# Altium schematic sheet MKXdbV2_ADC1.SchDoc
size A
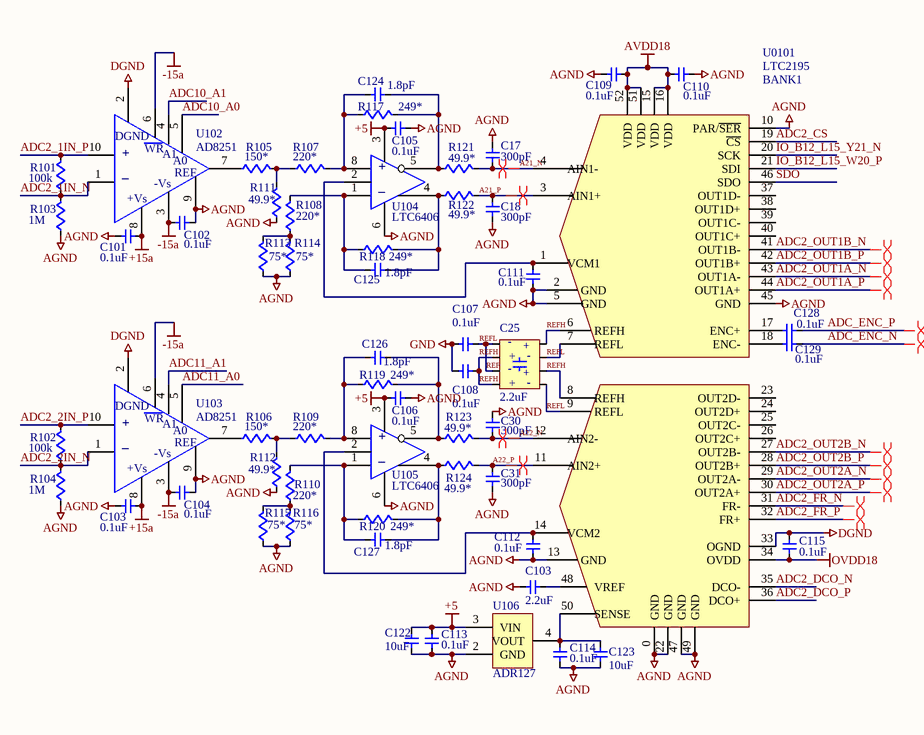
[diagram p0: MKXdbV2_ADC1.SchDoc]

## Parts
(Parts that share a designator on the sheet are numbered #1, #2 ... from top to bottom, then left to right.)
C17  300pF  [0603w]
C18  300pF  [0603w]
C25  2.2uF  [1206CLL]
C30  300pF  [0603w]
C31  300pF  [0603w]
C101  0.1uF  [0603w]
C102  0.1uF  [0603w]
C103#1  0.1uF  [0603w]
C103#2  2.2uF  [0603w]
C104  0.1uF  [0603w]
C105  0.1uF  [0603w]
C106  0.1uF  [0603w]
C107  0.1uF  [0603w]
C108  0.1uF  [0603w]
C109  0.1uF  [0603w]
C110  0.1uF  [0603w]
C111  0.1uF  [0603w]
C112  0.1uF  [0603w]
C113  0.1uF  [0603w]
C114  0.1uF  [0603w]
C115  0.1uF  [0603w]
C122  10uF  [0603w]
C123  10uF  [0603w]
C124  1.8pF  [0603w]
C125  1.8pF  [0603w]
C126  1.8pF  [0603w]
C127  1.8pF  [0603w]
C128  0.1uF  [1206]
C129  0.1uF  [1206]
R101  100k  [0603w]
R102  100k  [0603w]
R103  1M  [0603w]
R104  1M  [0603w]
R105  150*  [0603w]
R106  150*  [0603w]
R107  220*  [0603w]
R108  220*  [0603w]
R109  220*  [0603w]
R110  220*  [0603w]
R111  49.9*  [0603w]
R112  49.9*  [0603w]
R113  75*  [0603w]
R114  75*  [0603w]
R115  75*  [0603w]
R116  75*  [0603w]
R117  249*  [0603w]
R118  249*  [0603w]
R119  249*  [0603w]
R120  249*  [0603w]
R121  49.9*  [0603w]
R122  49.9*  [0603w]
R123  49.9*  [0603w]
R124  49.9*  [0603w]
U0101  LTC2195  [UKG - QFN52]
U102  AD8251  [MSOP10sm]
U103  AD8251  [MSOP10sm]
U104  LTC6406  [MSOP08]
U105  LTC6406  [MSOP08]
U106  ADR127  [TSOT-6]

## Nets
+5: C105.1 C106.1 C113.2 C122.1 U104.3 U105.3 U106.3(VIN)
+15a: C101.1 C103#1.1 U102.8 U103.8
-15a: C102.1 C104.1 U102.3 U102.6 U103.3 U103.6
AGND: C17.1 C18.2 C30.1 C31.2 C101.2 C102.2 C103#1.2 C103#2.2 C104.2 C105.2 C106.2 C109.2 C110.2 C111.2 C112.2 C113.1 C114.1 C122.2 C123.2 R103.1 R104.1 R111.1 R112.1 R113.1 R114.1 R115.1 R116.1 U0101.0(GND) U0101.2(GND) U0101.5(GND) U0101.10(PAR/~{SER}) U0101.13(GND) U0101.22(GND) U0101.45(GND) U0101.47(GND) U0101.49(GND) U102.9 U103.9 U104.6 U105.6 U106.2(GND)
AVDD18: C109.1 C110.1 U0101.15(VDD) U0101.16(VDD) U0101.51(VDD) U0101.52(VDD)
DGND: C115.1 U0101.33(OGND) U102.2 U103.2
GND: C107.2 C108.2
OVDD18: C115.2 U0101.34(OVDD)
A21_N: C17.2 R121.2 U0101.4(AIN1-)
A21_P: C18.1 R122.2 U0101.3(AIN1+)
A22_N: C30.2 R123.2 U0101.12(AIN2-)
A22_P: C31.1 R124.2 U0101.11(AIN2+)
ADC2_1IN_N: R101.1 R103.2 U102.1
ADC2_1IN_P: R101.2 U102.10
ADC2_2IN_N: R102.1 R104.2 U103.1
ADC2_2IN_P: R102.2 U103.10
ADC2_CS: U0101.19(~{CS})
ADC2_DCO_N: U0101.35(DCO-)
ADC2_DCO_P: U0101.36(DCO+)
ADC2_FR_N: U0101.31(FR-)
ADC2_FR_P: U0101.32(FR+)
ADC2_OUT1A_N: U0101.43(OUT1A-)
ADC2_OUT1A_P: U0101.44(OUT1A+)
ADC2_OUT1B_N: U0101.41(OUT1B-)
ADC2_OUT1B_P: U0101.42(OUT1B+)
ADC2_OUT2A_N: U0101.29(OUT2A-)
ADC2_OUT2A_P: U0101.30(OUT2A+)
ADC2_OUT2B_N: U0101.27(OUT2B-)
ADC2_OUT2B_P: U0101.28(OUT2B+)
ADC10_A0: U102.5
ADC10_A1: U102.4
ADC11_A0: U103.5
ADC11_A1: U103.4
ADC_ENC_N: C129.2
ADC_ENC_P: C128.2
IO_B12_L15_W20_P: U0101.21(SDI)
IO_B12_L15_Y21_N: U0101.20(SCK)
REFH: C25.2 C25.4 C25.6 C25.8 C108.1 U0101.6(REFH) U0101.8(REFH)
REFL: C25.1 C25.3 C25.5 C25.7 C107.1 U0101.7(REFL) U0101.9(REFL)
SDO: U0101.46(SDO)
NetC103#2_1: C103#2.1 U0101.48(VREF)
NetC111_1: C111.1 U0101.1(VCM1) U104.2
NetC112_1: C112.1 U0101.14(VCM2) U105.2
NetC114_2: C114.2 C123.1 U0101.50(SENSE) U106.4(VOUT)
NetC124_1: C124.1 R107.2 R117.1 U104.8
NetC124_2: C124.2 R117.2 R121.1 U104.5
NetC125_1: C125.1 R108.2 R118.1 U104.1
NetC125_2: C125.2 R118.2 R122.1 U104.4
NetC126_1: C126.1 R109.2 R119.1 U105.8
NetC126_2: C126.2 R119.2 R123.1 U105.5
NetC127_1: C127.1 R110.2 R120.1 U105.1
NetC127_2: C127.2 R120.2 R124.1 U105.4
NetC128_1: C128.1 U0101.17(ENC+)
NetC129_1: C129.1 U0101.18(ENC-)
NetR105_1: R105.1 U102.7
NetR105_2: R105.2 R107.1 R111.2
NetR106_1: R106.1 U103.7
NetR106_2: R106.2 R109.1 R112.2
NetR108_1: R108.1 R113.2 R114.2
NetR110_1: R110.1 R115.2 R116.2

Not connected (* = marked no-connect by the designer): U0101 23(OUT2D-) 24(OUT2D+) 25(OUT2C-) 26(OUT2C+) 37(OUT1D-) 38(OUT1D+) 39(OUT1C-) 40(OUT1C+); U106 1(NC) 5(NC) 6(NC)

## Layout directives
differential pair: A21_N, A21_P, A22_N, A22_P, ADC2_FR_N, ADC2_FR_P, ADC2_OUT1A_N, ADC2_OUT1A_P, ADC2_OUT1B_N, ADC2_OUT1B_P, ADC2_OUT2A_N, ADC2_OUT2A_P, ADC2_OUT2B_N, ADC2_OUT2B_P, ADC_ENC_N, ADC_ENC_P

## Notes on the sheet
- (near U0101) BANK1
- (in symbol AD8139) +; _
- (in symbol AD8251) DGND; WR; +; A1; A0; _; REF; -Vs; +Vs
- (in symbol CAP_SM Interdigitated) +

## Library data of the parts
C17 C18 C30 C31 C124-C127 = CAP_SM_1: capacitor; Supplier 1: Digi-Key
  C17 C18 C30 C31: Supplier Part Number 1: 490-1438-1-ND
  C124-C127: Supplier Part Number 1: 712-1328-1-ND
C25 = CAP_SM Interdigitated: INTERDIGITATED capacitor; Manufacturer: TDK Corporation; Manufacturer Part Number: CLLE1AX7S0G225M/0.95; Capacitance: 2.2µF; Voltage - Rated: 4V; Tolerance: ±20%; Temperature Coefficient: X7S; Supplier 1: Digi-Key; Supplier Part Number 1: 445-3406-1-ND; RoHS: RoHS Compliant; Category: Capacitors; Stock 1: 11249; Pricing 1: 1=0.68, 10=0.54, 100=0.325, 250=0.24376, 500=0.208, 1000=0.1625 (USD); Mounting Type: Surface Mount, MLCC; Operating Temperature: -55°C ~ 125°C; Applications: General Purpose; Ratings: -; Package / Case: 0805 (2012 Metric); Size / Dimension: 0.079" L x 0.049" W (2.00mm x 1.25mm); Height: -; Thickness: 0.037" (0.95mm); Lead Spacing: -; Features: Low ESL (Multi-Terminal); Packaging: Cut Tape (CT); Lead Style: -; ComponentLink1URL: http://www.tdk.com/pdf/uli_A11.pdf; ComponentLink1Description: http://www.tdk.com/pdf/uli_A11.pdf
C101 C102 C103#1 C104 C106-C115 = CAP_SM_1: capacitor; Manufacturer: Kemet; Manufacturer Part Number: C0603C104K3RACTU; Capacitance: 0.1µF; Temperature Coefficient: X7R; Tolerance: ±10%; Voltage - Rated: 25V; Applications: General Purpose; Category: Capacitors; ComponentLink1Description: http://www.kemet.com/datasheets&C0603C104K3RACTU; ComponentLink1URL: http://www.kemet.com/datasheets&C0603C104K3RACTU; Features: -; Lead Spacing: -; Lead Style: -; Mounting Type: Surface Mount, MLCC; Operating Temperature: -55°C ~ 125°C; Package / Case: 0603 (1608 Metric); Packaging: Cut Tape (CT); Pricing 1: 10=0.075, 100=0.027, 250=0.01952, 500=0.0144, 1000=0.00975 (USD); Ratings: -; RoHS: RoHS Compliant; Size / Dimension: 0.063" L x 0.031" W (1.60mm x 0.80mm); Stock 1: 1185883; Supplier 1: Digi-Key; Supplier Part Number 1: 399-1281-1-ND; Thickness: 0.034" (0.87mm)
C103#2 = CAP_SM_1: capacitor; Manufacturer: AVX Corporation; Manufacturer Part Number: 06036C225KAT2A; Capacitance: 2.2µF; Voltage - Rated: 6.3V; Tolerance: ±10%; Temperature Coefficient: X7R; Supplier 1: Digi-Key; Supplier Part Number 1: 478-5316-1-ND; RoHS: RoHS Compliant; Category: Capacitors; Stock 1: 284343; Pricing 1: 10=0.209, 100=0.1235, 500=0.07126, 1000=0.0494 (USD); Mounting Type: Surface Mount, MLCC; Operating Temperature: -55°C ~ 125°C; Applications: General Purpose; Ratings: -; Package / Case: 0603 (1608 Metric); Size / Dimension: 0.063" L x 0.032" W (1.60mm x 0.81mm); Height: -; Thickness: 0.035" (0.90mm); Lead Spacing: -; Features: -; Packaging: Cut Tape (CT); Lead Style: -; ComponentLink1URL: http://www.avx.com/docs/Catalogs/cx7r.pdf; ComponentLink1Description: http://www.avx.com/docs/Catalogs/cx7r.pdf
C105 = CAP_SM_1: capacitor; Manufacturer: Kemet; Manufacturer Part Number: C0603C104K3RACTU; Capacitance: 0.1µF; Voltage - Rated: 25V; Tolerance: ±10%; Temperature Coefficient: X7R; Supplier 1: Digi-Key; Supplier Part Number 1: 399-1281-1-ND; RoHS: RoHS Compliant; Category: Capacitors; Stock 1: 1185883; Pricing 1: 10=0.075, 100=0.027, 250=0.01952, 500=0.0144, 1000=0.00975 (USD); Mounting Type: Surface Mount, MLCC; Operating Temperature: -55°C ~ 125°C; Applications: General Purpose; Ratings: -; Package / Case: 0603 (1608 Metric); Size / Dimension: 0.063" L x 0.031" W (1.60mm x 0.80mm); Height: -; Thickness: 0.034" (0.87mm); Lead Spacing: -; Features: -; Packaging: Cut Tape (CT); Lead Style: -; ComponentLink1URL: http://www.kemet.com/datasheets&C0603C104K3RACTU; ComponentLink1Description: http://www.kemet.com/datasheets&C0603C104K3RACTU
C122 C123 = CAP_SM_1: capacitor; Manufacturer: Murata Electronics North America; Manufacturer Part Number: GRM188R60J106ME47D; Capacitance: 10µF; Voltage - Rated: 6.3V; Tolerance: ±20%; Temperature Coefficient: X5R; Supplier 1: Digi-Key; Supplier Part Number 1: 490-3896-1-ND; RoHS: RoHS Compliant; Category: Capacitors; Stock 1: 1274844; Pricing 1: 1=0.47, 10=0.369, 50=0.2428, 100=0.1926, 250=0.14236, 500=0.11056, 1000=0.0871 (USD); Mounting Type: Surface Mount, MLCC; Operating Temperature: -55°C ~ 85°C; Applications: General Purpose; Ratings: -; Package / Case: 0603 (1608 Metric); Size / Dimension: 0.063" L x 0.031" W (1.60mm x 0.80mm); Height: -; Thickness: 0.035" (0.90mm); Lead Spacing: -; Features: -; Packaging: Cut Tape (CT); Lead Style: -; ComponentLink1URL: http://search.murata.co.jp/Ceramy/image/img/PDF/ENG/GRM188R60J106ME47.pdf; ComponentLink1Description: http://search.murata.co.jp/Ceramy/image/img/PDF/ENG/GRM188R60J106ME47.pdf
C128 C129 = CAP_SM_1: capacitor; Manufacturer: Murata Electronics North America; Manufacturer Part Number: GRM31C5C1E104JA01L; Capacitance: 0.1µF; Voltage - Rated: 25V; Tolerance: ±5%; Temperature Coefficient: C0G, NP0; Supplier 1: Digi-Key; Supplier Part Number 1: 490-1767-1-ND; RoHS: RoHS Compliant; Category: Capacitors; Stock 1: 374793; Pricing 1: 1=0.57, 10=0.48, 50=0.3436, 100=0.3007, 250=0.23628, 500=0.2148, 1000=0.17184 (USD); Mounting Type: Surface Mount, MLCC; Operating Temperature: -55°C ~ 125°C; Applications: General Purpose; Ratings: -; Package / Case: 1206 (3216 Metric); Size / Dimension: 0.126" L x 0.063" W (3.20mm x 1.60mm); Height: -; Thickness: 0.071" (1.80mm); Lead Spacing: -; Features: -; Packaging: Cut Tape (CT); Lead Style: -; ComponentLink1URL: http://search.murata.co.jp/Ceramy/image/img/PDF/ENG/GRM31C5C1E104JA01.pdf; ComponentLink1Description: http://search.murata.co.jp/Ceramy/image/img/PDF/ENG/GRM31C5C1E104JA01.pdf
R101 R102 = RES_SM: resistor; Manufacturer: Yageo; Manufacturer Part Number: RC0603FR-07100KL; Power (Watts): 0.1W, 1/10W; Temperature Coefficient: ±100ppm/°C; Tolerance: ±1%; Supplier 1: Digi-Key; Supplier Part Number 1: 311-100KHRCT-ND; RoHS: RoHS Compliant; Category: Resistors; Stock 1: 3397757; Pricing 1: 10=0.014, 50=0.0104, 100=0.0079, 250=0.00584, 500=0.00432, 1000=0.00288 (USD); Resistance (Ohms): 100K; Composition: Thick Film; Features: -; Size / Dimension: 0.063" L x 0.031" W (1.60mm x 0.80mm); Height: 0.018" (0.45mm); Number of Terminations: 2; Packaging: Cut Tape (CT); Package / Case: 0603 (1608 Metric); ComponentLink1URL: http://www.yageo.com/documents/recent/PYu-RC0603_51_RoHS_L_4.pdf; ComponentLink1Description: http://www.yageo.com/documents/recent/PYu-RC0603_51_RoHS_L_4.pdf
R103 R104 = RES_SM: resistor; Manufacturer: Yageo; Manufacturer Part Number: RC0603FR-071ML; Power (Watts): 0.1W, 1/10W; Temperature Coefficient: ±100ppm/°C; Tolerance: ±1%; Supplier 1: Digi-Key; Supplier Part Number 1: 311-1.00MHRCT-ND; RoHS: RoHS Compliant; Category: Resistors; Stock 1: 1849601; Pricing 1: 10=0.014, 50=0.0104, 100=0.0079, 250=0.00584, 500=0.00432, 1000=0.00288 (USD); Resistance (Ohms): 1M; Composition: Thick Film; Features: -; Size / Dimension: 0.063" L x 0.031" W (1.60mm x 0.80mm); Height: 0.018" (0.45mm); Number of Terminations: 2; Packaging: Cut Tape (CT); Package / Case: 0603 (1608 Metric); ComponentLink1URL: http://www.yageo.com/documents/recent/PYu-RC0603_51_RoHS_L_4.pdf; ComponentLink1Description: http://www.yageo.com/documents/recent/PYu-RC0603_51_RoHS_L_4.pdf
R105-R110 R117-R120 = RES_SM: resistor; Supplier 1: Digi-Key
  R105 R106: Supplier Part Number 1: RNCS0603BKE150RCT-ND
  R107-R110: Supplier Part Number 1: RG16P220BCT-ND
  R117-R120: Supplier Part Number 1: RNCS0603BKE249RCT-ND
R111 R112 R121-R124 = RES_SM: resistor; Manufacturer: Stackpole Electronics Inc; Manufacturer Part Number: RNCS0603BKE49R9; Resistance (Ohms): 49.9; Power (Watts): 0.063W, 1/16W; Temperature Coefficient: ±25ppm/°C; Tolerance: ±0.1%; Supplier 1: Digi-Key; Supplier Part Number 1: RNCS0603BKE49R9CT-ND; RoHS: RoHS Compliant; Category: Resistors; Stock 1: 13782; Pricing 1: 1=0.7, 10=0.475, 50=0.2876, 100=0.2375, 250=0.18752, 500=0.16 (USD); Composition: Thin Film; Features: Anti-Corrosive, Moisture Resistant; Size / Dimension: 0.061" L x 0.031" W (1.55mm x 0.80mm); Height: 0.018" (0.45mm); Number of Terminations: 2; Packaging: Cut Tape (CT); Package / Case: 0603 (1608 Metric); ComponentLink1URL: http://www.seielect.com/Catalog/SEI-rncs.pdf; ComponentLink1Description: http://www.seielect.com/Catalog/SEI-rncs.pdf
R113-R116 = RES_SM: resistor; Manufacturer: Stackpole Electronics Inc; Manufacturer Part Number: RNCS0603BKE75R0; Resistance (Ohms): 75; Power (Watts): 0.063W, 1/16W; Temperature Coefficient: ±25ppm/°C; Tolerance: ±0.1%; Supplier 1: Digi-Key; Supplier Part Number 1: RNCS0603BKE75R0CT-ND; RoHS: RoHS Compliant; Category: Resistors; Stock 1: 2583; Pricing 1: 1=0.7, 10=0.475, 50=0.2876, 100=0.2375, 250=0.18752, 500=0.16 (USD); Composition: Thin Film; Features: Anti-Corrosive, Moisture Resistant; Size / Dimension: 0.061" L x 0.031" W (1.55mm x 0.80mm); Height: 0.018" (0.45mm); Number of Terminations: 2; Packaging: Cut Tape (CT); Package / Case: 0603 (1608 Metric); ComponentLink1URL: http://www.seielect.com/Catalog/SEI-rncs.pdf; ComponentLink1Description: http://www.seielect.com/Catalog/SEI-rncs.pdf
U0101 = LTC2195: 16 bit, low power, dual ADC; Supplier 1: Digi-Key; Supplier Part Number 1: LTC2195CUKG#PBF-ND
U102 = AD8251: Programmable Gain Instumentation Amp; Supplier 1: Digi-Key; Supplier Part Number 1: AD8251ARMZ-ND
U103 = AD8251: IC AMP INST ICMOS LDRIFT 10MSOP; Supplier 1: Digi-Key; Supplier Part Number 1: AD8251ARMZ-ND
U104 U105 = AD8139: Differential ADC Driver; Supplier 1: Digi-Key; Supplier Part Number 1: LTC6406CMS8E#PBF-ND
U106 = ADR12x: Voltage Reference; Manufacturer: Analog Devices Inc; Manufacturer Part Number: ADR127AUJZ-REEL7; Reference Type: Series, Precision; Voltage - Output: 1.25V; Tolerance: ±0.24%; Temperature Coefficient: 25ppm/°C; Voltage - Input: 2.7 V ~ 18 V; Number of Channels: 1; Current - Quiescent: 95µA; Current - Output: 5mA; Supplier 1: Digi-Key; Supplier Part Number 1: ADR127AUJZ-REEL7CT-ND; RoHS: RoHS Compliant; Category: Integrated Circuits (ICs); Stock 1: 17098; Pricing 1: 1=3.22, 25=2.484, 100=2.254, 250=2.024, 500=1.748 (USD); Current - Cathode: -; Operating Temperature: -40°C ~ 125°C; Mounting Type: Surface Mount; Package / Case: TSOT-23-6, TSOT-6; Supplier Device Package: TSOT-6; Packaging: Cut Tape (CT); ComponentLink1URL: http://www.analog.com/static/imported-files/Data_Sheets/ADR121_125_127.pdf; ComponentLink1Description: http://www.analog.com/static/imported-files/Data_Sheets/ADR121_125_127.pdf